# EAGLE design LaserScanner (EAGLE 9.1.3)
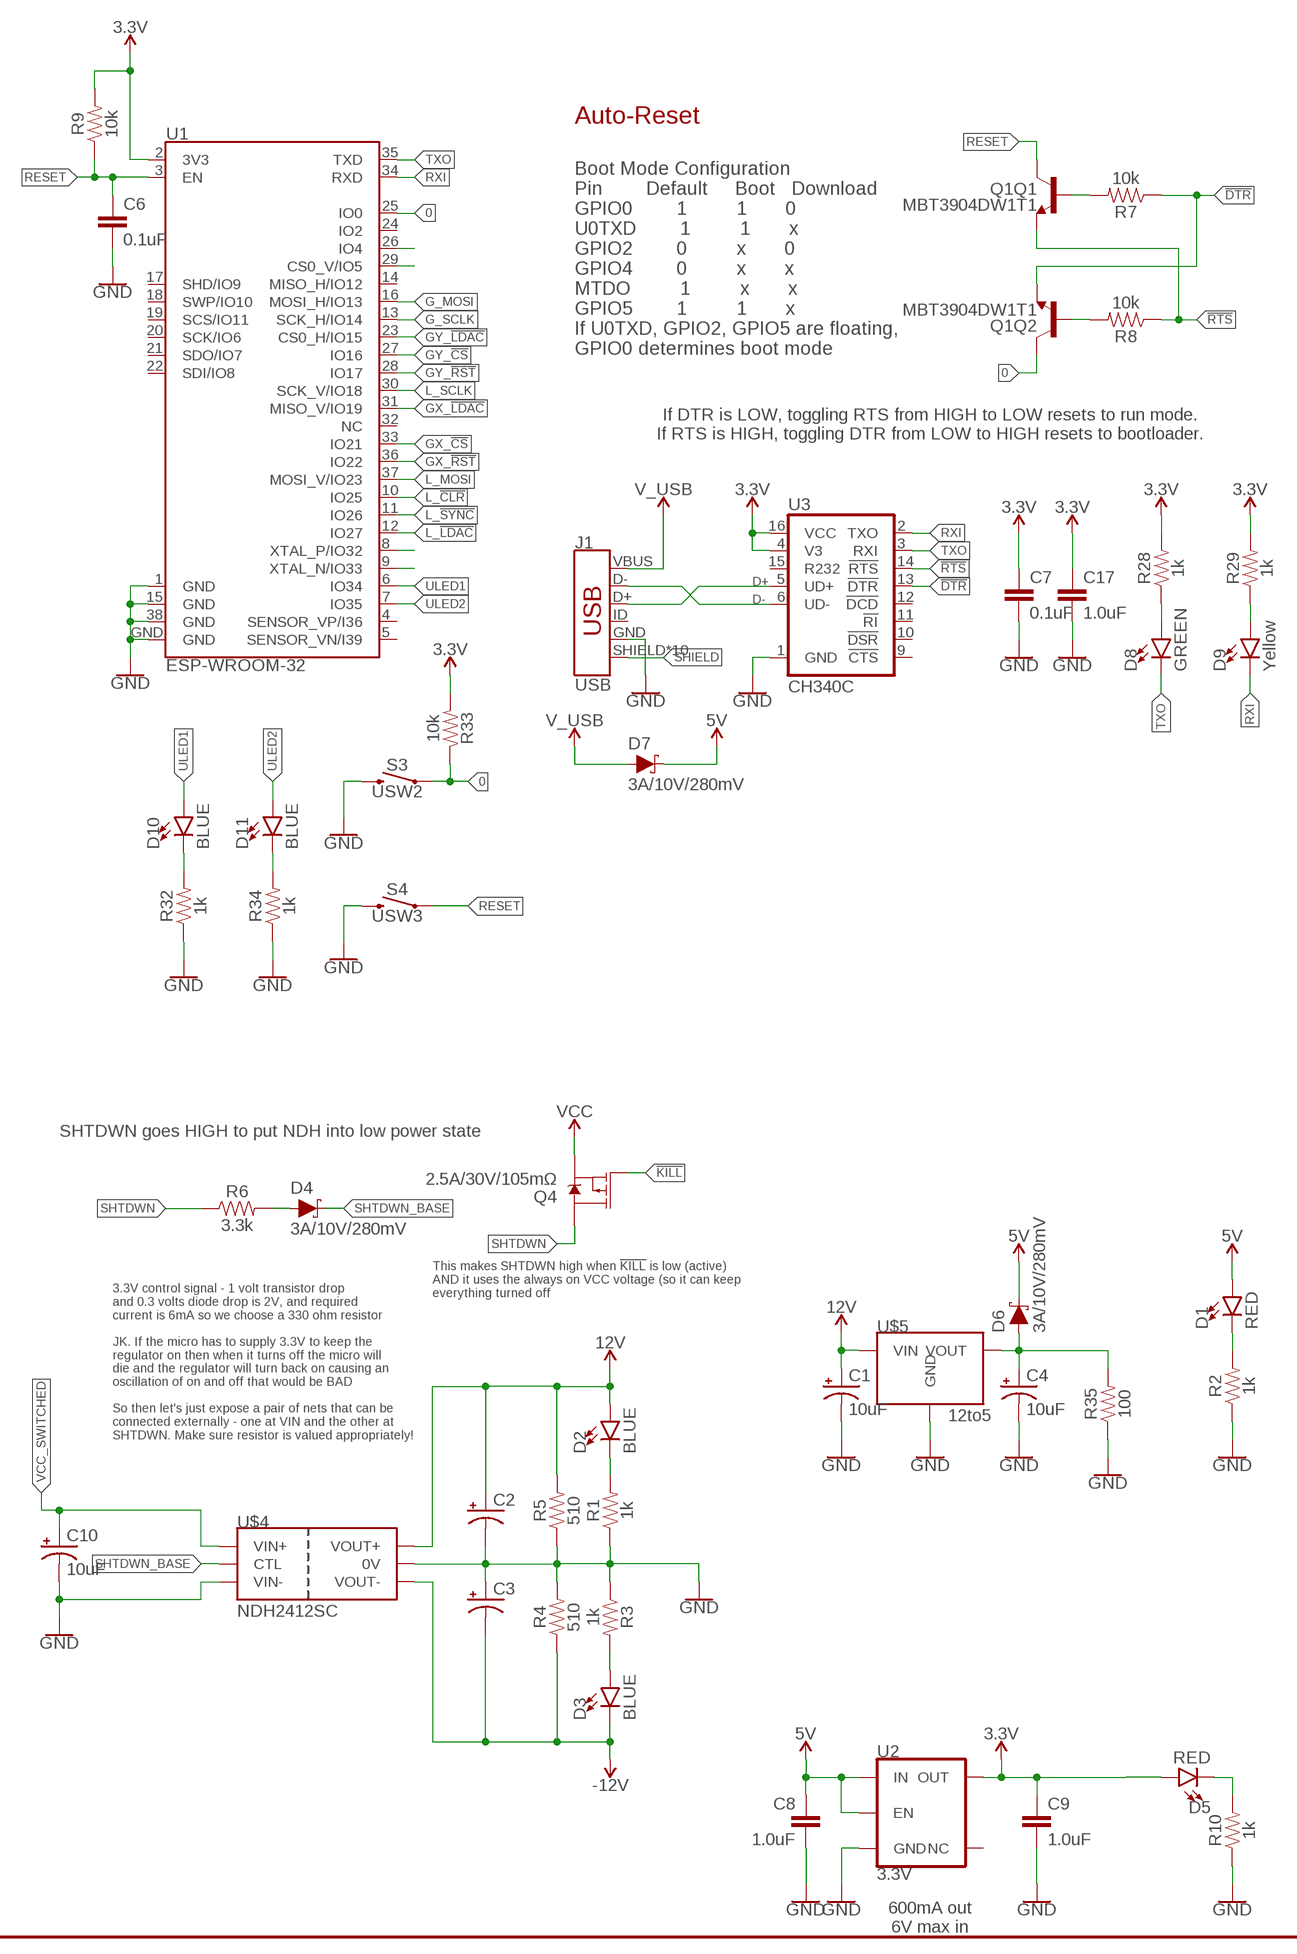
[diagram p0: schematic, sheet 1, part 1 of 2]
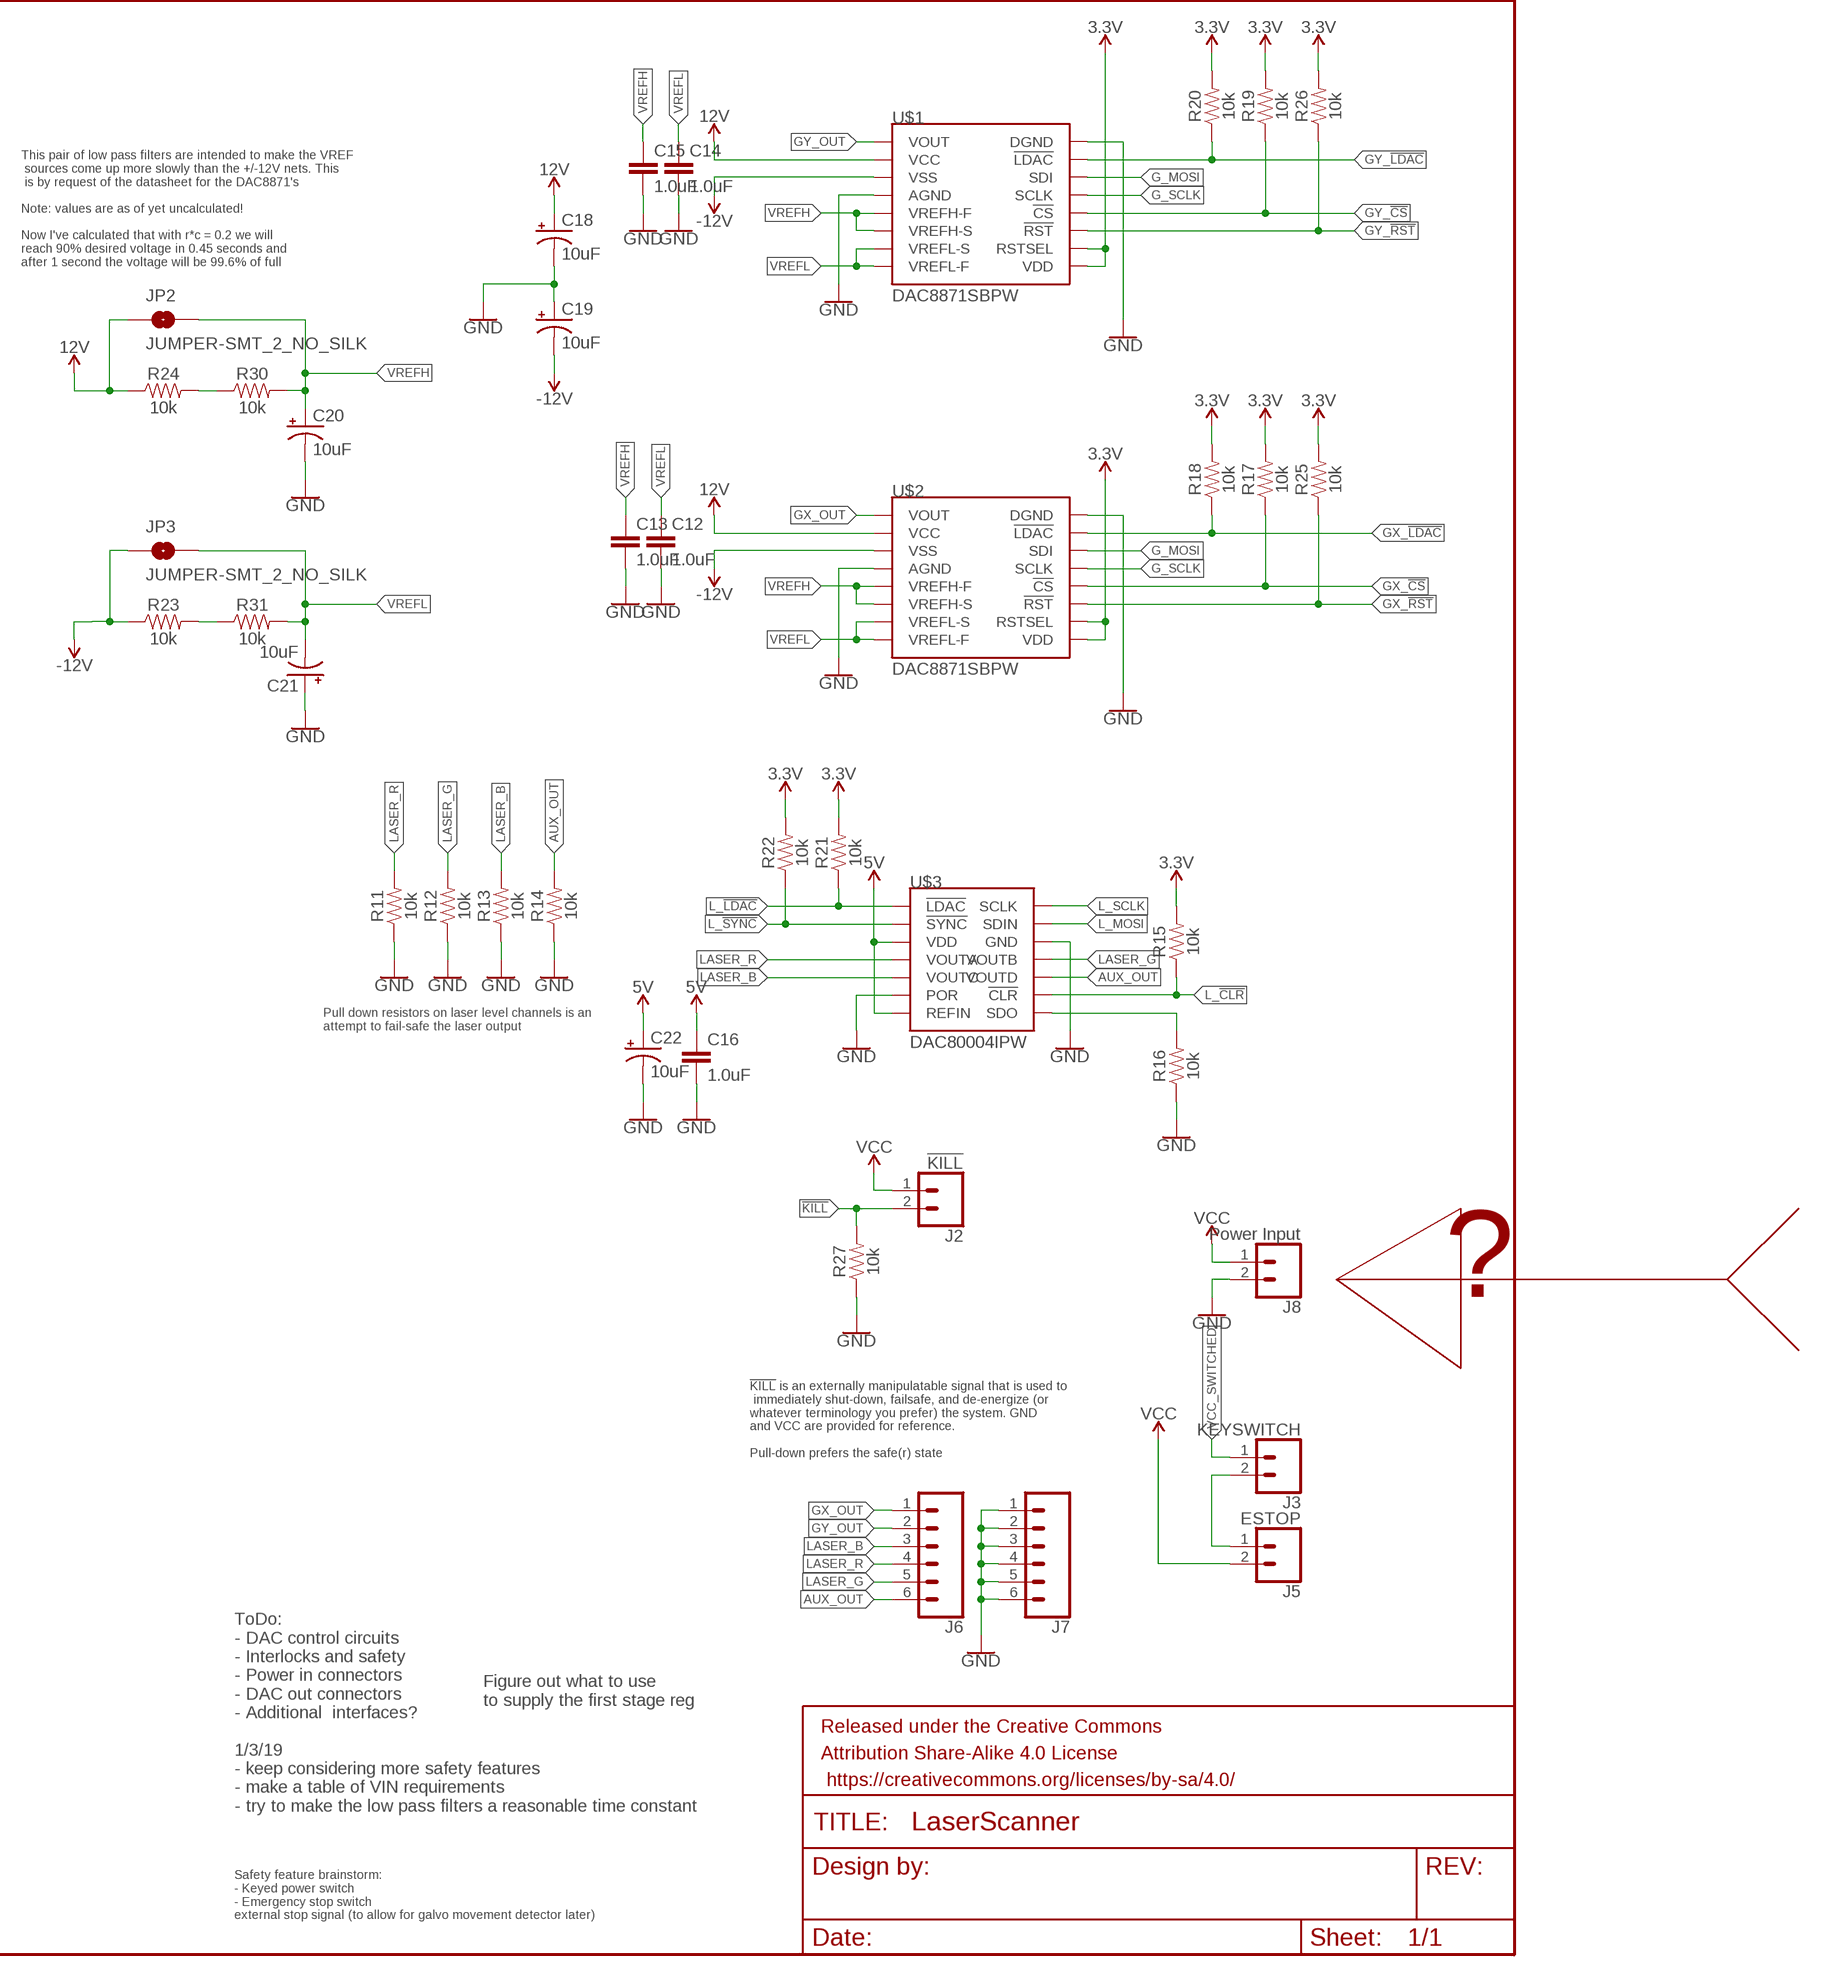
[diagram p1: schematic, sheet 1, part 2 of 2]

## Parts
C1  10uF  10UF-POLAR-EIA3216-16V-10%(TANT)  [EIA3216]
C2  47UF-POLAR-PANASONIC_D-50V-20%  [PANASONIC_D]
C3  47UF-POLAR-PANASONIC_D-50V-20%  [PANASONIC_D]
C4  10uF  10UF-POLAR-EIA3216-16V-10%(TANT)  [EIA3216]
C6  0.1uF  0.1UF-0603-25V-(+80/-20%)  [0603]
C7  0.1uF  0.1UF-0603-25V-5%  [0603]
C8  1.0uF  1.0UF-0603-16V-10%  [0603]
C9  1.0uF  1.0UF-0603-16V-10%  [0603]
C10  10uF  10UF-POLAR-EIA3216-16V-10%(TANT)  [EIA3216]
C12  1.0uF  1.0UF-0603-16V-10%-X7R  [0603]
C13  1.0uF  1.0UF-0603-16V-10%-X7R  [0603]
C14  1.0uF  1.0UF-0603-16V-10%-X7R  [0603]
C15  1.0uF  1.0UF-0603-16V-10%-X7R  [0603]
C16  1.0uF  1.0UF-0603-16V-10%-X7R  [0603]
C17  1.0uF  1.0UF-0603-16V-10%-X7R  [0603]
C18  10uF  10UF-POLAR-EIA3216-16V-10%(TANT)  [EIA3216]
C19  10uF  10UF-POLAR-EIA3216-16V-10%(TANT)  [EIA3216]
C20  10uF  10UF-POLAR-EIA3216-16V-10%(TANT)  [EIA3216]
C21  10uF  10UF-POLAR-EIA3216-16V-10%(TANT)  [EIA3216]
C22  10uF  10UF-POLAR-EIA3216-16V-10%(TANT)  [EIA3216]
D1  RED  LED-RED0603  [LED-0603]
D2  BLUE  LED-BLUE0603  [LED-0603]
D3  BLUE  LED-BLUE0603  [LED-0603]
D4  3A/10V/280mV  DIODE-SCHOTTKY-BAT60A  [SOD-323]
D5  RED  LED-RED0603  [LED-0603]
D6  3A/10V/280mV  DIODE-SCHOTTKY-BAT60A  [SOD-323]
D7  3A/10V/280mV  DIODE-SCHOTTKY-BAT60A  [SOD-323]
D8  GREEN  LED-GREEN0603  [LED-0603]
D9  Yellow  LED-YELLOW0603  [LED-0603]
D10  BLUE  LED-BLUE0603  [LED-0603]
D11  BLUE  LED-BLUE0603  [LED-0603]
FRAME1  FRAME-LEDGER  [CREATIVE_COMMONS]
J1  USB  USB_MICRO-B_HALF_PTH_MILL  [USB-MICROB-PTH-MILL]
J2  !KILL!  CONN_021X02_NO_SILK  [1X02_NO_SILK]
J3  KEYSWITCH  CONN_021X02_NO_SILK  [1X02_NO_SILK]
J5  ESTOP  CONN_021X02_NO_SILK  [1X02_NO_SILK]
J6  CONN_06NO_SILK_FEMALE_PTH  [1X06_NO_SILK]
J7  CONN_06NO_SILK_FEMALE_PTH  [1X06_NO_SILK]
J8  Power Input  CONN_021X02_NO_SILK  [1X02_NO_SILK]
JP2  JUMPER-SMT_2_NO_SILK  [SMT-JUMPER_2_NO_SILK]
JP3  JUMPER-SMT_2_NO_SILK  [SMT-JUMPER_2_NO_SILK]
Q1  MBT3904DW1T1  TRANS_NPN_DUAL-MBT3904DW1T1  [SC70-6]
Q4  2.5A/30V/105mΩ  MOSFET_PCH-DMG2307L  [SOT23-3]
R1  1k  1KOHM-0603-1/10W-1%  [0603]
R2  1k  1KOHM-0603-1/10W-1%  [0603]
R3  1k  1KOHM-0603-1/10W-1%  [0603]
R4  510  510OHM-2010-1/2W-5%  [2010]
R5  510  510OHM-2010-1/2W-5%  [2010]
R6  3.3k  3.3KOHM-0603-1/10W-1%  [0603]
R7  10k  10KOHM-0603-1/10W-1%  [0603]
R8  10k  10KOHM-0603-1/10W-1%  [0603]
R9  10k  10KOHM-0603-1/10W-1%  [0603]
R10  1k  1KOHM-0603-1/10W-1%  [0603]
R11  10k  10KOHM-0603-1/10W-1%  [0603]
R12  10k  10KOHM-0603-1/10W-1%  [0603]
R13  10k  10KOHM-0603-1/10W-1%  [0603]
R14  10k  10KOHM-0603-1/10W-1%  [0603]
R15  10k  10KOHM-0603-1/10W-1%  [0603]
R16  10k  10KOHM-0603-1/10W-1%  [0603]
R17  10k  10KOHM-0603-1/10W-1%  [0603]
R18  10k  10KOHM-0603-1/10W-1%  [0603]
R19  10k  10KOHM-0603-1/10W-1%  [0603]
R20  10k  10KOHM-0603-1/10W-1%  [0603]
R21  10k  10KOHM-0603-1/10W-1%  [0603]
R22  10k  10KOHM-0603-1/10W-1%  [0603]
R23  10k  10KOHM-0603-1/10W-1%  [0603]
R24  10k  10KOHM-0603-1/10W-1%  [0603]
R25  10k  10KOHM-0603-1/10W-1%  [0603]
R26  10k  10KOHM-0603-1/10W-1%  [0603]
R27  10k  10KOHM-0603-1/10W-1%  [0603]
R28  1k  1KOHM-0603-1/10W-1%  [0603]
R29  1k  1KOHM-0603-1/10W-1%  [0603]
R30  10k  10KOHM-0603-1/10W-1%  [0603]
R31  10k  10KOHM-0603-1/10W-1%  [0603]
R32  1k  1KOHM-0603-1/10W-1%  [0603]
R33  10k  10KOHM-0603-1/10W-1%  [0603]
R34  1k  1KOHM-0603-1/10W-1%  [0603]
R35  100  100OHM-0603-1/4W-5%  [0603]
S3  USW2  MOMENTARY-SWITCH-SPST-SMD-5.2-REDUNDANT  [TACTILE_SWITCH_SMD_5.2MM]
S4  USW3  MOMENTARY-SWITCH-SPST-SMD-5.2-REDUNDANT  [TACTILE_SWITCH_SMD_5.2MM]
U1  ESP-WROOM-32  [ESP-WROOM-32]
U2  3.3V  V_REG_AP2112K-3.3V  [SOT23-5]
U3  CH340C  [SO016]
U$1  DAC8871SBPW  [TSSOP16]
U$2  DAC8871SBPW  [TSSOP16]
U$3  DAC80004IPW  [TSSOP14]
U$4  NDH2412SC  [NDH]
U$5  12to5  R-78E3.3-1.0  [RE-78E]

## Nets
0: Q1.6(Q2:C) R33.1 S3.1 S3.2 U1.25(IO0)
3.3V: C7.1 C9.1 C17.1 D5.A R9.2 R15.2 R17.2 R18.2 R19.2 R20.2 R21.2 R22.2 R25.2 R26.2 R28.2 R29.2 R33.2 U1.2(3V3) U2.5(OUT) U3.4(V3) U3.16(VCC) U$1.9(VDD) U$1.10(RSTSEL) U$2.9(VDD) U$2.10(RSTSEL)
5V: C8.1 C16.1 C22.+ D1.A D6.C D7.C U2.1(IN) U2.3(EN) U$3.3(VDD) U$3.7(REFIN)
12V: C1.+ C2.+ C18.+ D2.A JP2.1 R5.2 R24.1 U$1.2(VCC) U$2.2(VCC) U$4.6(VOUT+) U$5.1(VIN)
!DTR: Q1.1(Q2:E) R7.1 U3.13(!DTR)
!KILL: J2.2 Q4.1(G) R27.2
!RTS: Q1.4(Q1:E) R8.1 U3.14(!RTS)
-12V: C3.- C19.- D3.C JP3.1 R4.1 R23.1 U$1.3(VSS) U$2.3(VSS) U$4.9(VOUT-)
AUX_OUT: J6.6 R14.2 U$3.10(VOUTD)
D+: J1.D+ U3.5(UD+)
D-: J1.D- U3.6(UD-)
G_MOSI: U1.16(MOSI_H/IO13) U$1.14(SDI) U$2.14(SDI)
G_SCLK: U1.13(SCK_H/IO14) U$1.13(SCLK) U$2.13(SCLK)
GND: C1.- C2.- C3.+ C4.- C6.2 C7.2 C8.2 C9.2 C10.- C12.2 C13.2 C14.2 C15.2 C16.2 C17.2 C18.- C19.+ C20.- C21.+ C22.- J1.GND J7.1 J7.2 J7.3 J7.4 J7.5 J7.6 J8.2 R1.1 R2.1 R3.1 R4.2 R5.1 R10.1 R11.1 R12.1 R13.1 R14.1 R16.1 R27.1 R32.1 R34.1 R35.1 S3.3 S3.4 S4.3 S4.4 U1.1(GND) U1.15(GND) U1.38(GND) U1.GND U2.2(GND) U3.1(GND) U$1.4(AGND) U$1.16(DGND) U$2.4(AGND) U$2.16(DGND) U$3.6(POR) U$3.12(GND) U$4.1(VIN-) U$4.7(0V) U$5.2(GND)
GX_!CS: R17.1 U1.33(IO21) U$2.12(!CS)
GX_!LDAC: R18.1 U1.31(MISO_V/IO19) U$2.15(!LDAC)
GX_!RST: R25.1 U1.36(IO22) U$2.11(!RST)
GX_OUT: J6.1 U$2.1(VOUT)
GY_!CS: R19.1 U1.27(IO16) U$1.12(!CS)
GY_!LDAC: R20.1 U1.23(CS0_H/IO15) U$1.15(!LDAC)
GY_!RST: R26.1 U1.28(IO17) U$1.11(!RST)
GY_OUT: J6.2 U$1.1(VOUT)
L_!CLR: R15.1 U1.10(IO25) U$3.9(!CLR)
L_!LDAC: R21.1 U1.12(IO27) U$3.1(!LDAC)
L_!SYNC: R22.1 U1.11(IO26) U$3.2(!SYNC)
L_MOSI: U1.37(MOSI_V/IO23) U$3.13(SDIN)
L_SCLK: U1.30(SCK_V/IO18) U$3.14(SCLK)
LASER_B: J6.3 R13.2 U$3.5(VOUTC)
LASER_G: J6.5 R12.2 U$3.11(VOUTB)
LASER_R: J6.4 R11.2 U$3.4(VOUTA)
N$1: D1.C R2.2
N$2: R16.2 U$3.8(SDO)
N$3: D2.C R1.2
N$4: D4.A R6.2
N$5: D3.A R3.2
N$6: D5.C R10.2
N$7: C4.+ D6.A R35.2 U$5.3(VOUT)
N$8: U1.26(IO4)
N$9: J3.2 J5.1
N$10: Q1.5(Q1:B) R7.2
N$11: U1.29(CS0_V/IO5)
N$12: Q1.2(Q2:B) R8.2
N$13: D8.A R28.1
N$14: D9.A R29.1
N$15: R24.2 R30.1
N$16: R23.2 R31.1
N$17: D10.C R32.2
N$18: D11.C R34.2
N$22: U1.8(XTAL_P/IO32)
N$23: U1.9(XTAL_N/IO33)
RESET: C6.1 Q1.3(Q1:C) R9.1 S4.1 S4.2 U1.3(EN)
RXI: D9.C U1.34(RXD) U3.2(TXO)
SHIELD: J1.SHIELD J1.SHIELD2(SHIELD) J1.SHIELD3(SHIELD) J1.SHIELD4(SHIELD) J1.SHIELD5(SHIELD) J1.SHIELD6(SHIELD) J1.SHIELD7(SHIELD) J1.SHIELD8(SHIELD) J1.SHIELD9(SHIELD) J1.SHIELD10(SHIELD)
SHTDWN: Q4.3(D) R6.1
SHTDWN_BASE: D4.C U$4.3(CTL)
TXO: D8.C U1.35(TXD) U3.3(RXI)
ULED1: D10.A U1.6(IO34)
ULED2: D11.A U1.7(IO35)
V_USB: D7.A J1.VBUS
VCC: J2.1 J5.2 J8.1 Q4.2(S)
VCC_SWITCHED: C10.+ J3.1 U$4.2(VIN+)
VREFH: C13.1 C15.1 C20.+ JP2.2 R30.2 U$1.5(VREFH-F) U$1.6(VREFH-S) U$2.5(VREFH-F) U$2.6(VREFH-S)
VREFL: C12.1 C14.1 C21.- JP3.2 R31.2 U$1.7(VREFL-S) U$1.8(VREFL-F) U$2.7(VREFL-S) U$2.8(VREFL-F)
Unconnected: J1.ID U1.4(SENSOR_VP/I36) U1.5(SENSOR_VN/I39) U1.14(MISO_H/IO12) U1.17(SHD/IO9) U1.18(SWP/IO10) U1.19(SCS/IO11) U1.20(SCK/IO6) U1.21(SDO/IO7) U1.22(SDI/IO8) U1.24(IO2) U1.32(NC) U2.4(NC) U3.9(!CTS) U3.10(!DSR) U3.11(!RI) U3.12(!DCD) U3.15(R232)

## Notes on the sheet
- Auto-Reset
- This pair of low pass filters are intended to make the VREF
   sources come up more slowly than the +/-12V nets. This
   is by request of the datasheet for the DAC8871's
  
  Note: values are as of yet uncalculated!
  
  Now I've calculated that with r*c = 0.2 we will 
  reach 90% desired voltage in 0.45 seconds and 
  after 1 second the voltage will be 99.6% of full
- Boot Mode Configuration
  Pin        Default     Boot   Download
  GPIO0        1         1       0
  U0TXD        1         1       x
  GPIO2        0         x       0
  GPIO4        0         x       x
  MTDO         1         x       x
  GPIO5        1         1       x
  If U0TXD, GPIO2, GPIO5 are floating, 
  GPIO0 determines boot mode
- If DTR is LOW, toggling RTS from HIGH to LOW resets to run mode.
  If RTS is HIGH, toggling DTR from LOW to HIGH resets to bootloader.
- Pull down resistors on laser level channels is an 
  attempt to fail-safe the laser output
- SHTDWN goes HIGH to put NDH into low power state
- ?
- This makes SHTDWN high when !KILL! is low (active)
  AND it uses the always on VCC voltage (so it can keep 
  everything turned off
- 3.3V control signal - 1 volt transistor drop 
  and 0.3 volts diode drop is 2V, and required 
  current is 6mA so we choose a 330 ohm resistor
  
  JK. If the micro has to supply 3.3V to keep the 
  regulator on then when it turns off the micro will 
  die and the regulator will turn back on causing an 
  oscillation of on and off that would be BAD
  
  So then let's just expose a pair of nets that can be 
  connected externally - one at VIN and the other at 
  SHTDWN. Make sure resistor is valued appropriately!
- !KILL! is an externally manipulatable signal that is used to
   immediately shut-down, failsafe, and de-energize (or 
  whatever terminology you prefer) the system. GND 
  and VCC are provided for reference.
  
  Pull-down prefers the safe(r) state
- Figure out what to use
  to supply the first stage reg
- ToDo: 
  - DAC control circuits
  - Interlocks and safety
  - Power in connectors
  - DAC out connectors
  - Additional  interfaces?
  
  1/3/19
  - keep considering more safety features
  - make a table of VIN requirements
  - try to make the low pass filters a reasonable time constant
- 600mA out
  6V max in
- Safety feature brainstorm:
  - Keyed power switch
  - Emergency stop switch
  external stop signal (to allow for galvo movement detector later)

## Library data of the parts
C1 C4 C10 C18-C22 = SparkFun-Capacitors:10UF-POLAR: 10.0µF polarized capacitors A capacitor is a passive two-terminal electrical component used to store electrical energy temporarily in an electric field.; PROD_ID: CAP-00811
C2 C3 = SparkFun-Capacitors:47UF-POLAR: 47µF polarized capacitors A capacitor is a passive two-terminal electrical component used to store electrical energy temporarily in an electric field.
C6 = SparkFun-Capacitors:0.1UF: 0.1µF ceramic capacitors A capacitor is a passive two-terminal electrical component used to store electrical energy temporarily in an electric field.; PROD_ID: CAP-00810
C7 = SparkFun-Capacitors:0.1UF: 0.1µF ceramic capacitors A capacitor is a passive two-terminal electrical component used to store electrical energy temporarily in an electric field.; PROD_ID: CAP-08604
C8 C9 = SparkFun-Capacitors:1.0UF: 1µF ceramic capacitors A capacitor is a passive two-terminal electrical component used to store electrical energy temporarily in an electric field.; PROD_ID: CAP-00868
C12-C17 = SparkFun-Capacitors:1.0UF: 1µF ceramic capacitors A capacitor is a passive two-terminal electrical component used to store electrical energy temporarily in an electric field.; PROD_ID: CAP-13930
D1 D5 = SparkFun-LED:LED-RED: Red SMD LED Used in manufacturing of most products at SparkFun Packages: 0603 - SMD 0603 package [Product Link] <http://docs.avagotech.com/docs/AV02-0551EN> 0603 SMART - SMD 0603 SMART package ( more efficient and expensive)[Product Link] <http://www.osram-os.com/Graphics/XPic2/00077099_0.pdf> 1206 - SMD1206 package [Product Link] <https://www.sparkfun.com/datasheets/DevTools/LilyPad/Q150OVS4.pdff> SparkFun Products: Pro Mini 328 -5V <https://www.sparkfun.com/products/821> RedBoard <https://www.sparkfun.com/products/12757> IOIO-OTG <https://www.sparkfun.com/products/13613>; PROD_ID: DIO-00819
D2 D3 D10 D11 = SparkFun-LED:LED-BLUE: Blue SMD LED Used in manufacturing of various products at SparkFun Packages: 0603 - SMD 0603 package [Product Link] <http://www.digikey.com/product-detail/en/SMLE12BC7TT86/511-1589-2-ND/1641808> 1206 - SMD1206 package [Product Link] <http://www.digikey.com/product-detail/en/lite-on-inc/LTST-C150TBKT/160-1643-1-ND/573584> SparkFun Products: ESP8266 Thing-Dev Board <https://www.sparkfun.com/products/13711> RedBoard <https://www.sparkfun.com/products/12757>; PROD_ID: DIO-08575
D4 D6 D7 = SparkFun-DiscreteSemi:DIODE-SCHOTTKY: Schottky diode A Schottky diode is a semiconductor diode which has a low forward voltage drop and a very fast switching action.; PROD_ID: DIO-14072
D8 = SparkFun-LED:LED-GREEN: Green SMD LED Used in manufacturing of various products at SparkFun Packages: 0603 - SMD 0603 package [Product Link] <http://www.futureelectronics.com/en/technologies/semiconductors/optoelectronics/leds/Pages/9894312-LTST-C190GKT.aspx?CrossPart=HSMG-C190&IM=0> LilyPad 1206 - SMD1206 LilyPad package [Product Link] <http://www.futureelectronics.com/en/Technologies/Product.aspx?ProductID=IN150NGHARVATEKCORPORATION2049943&IM=0> 1206 - SMD1206 package [Product Link] <http://www.futureelectronics.com/en/technologies/semiconductors/optoelectronics/leds/Pages/8315665-LTST-C150KGKT.aspx?IM=0> 1206 Bottom Mount -SMD 1206 Bottom Mount [Product Link] <http://www.digikey.com/product-detail/en/lite-on-inc/LTST-C230KGKT/160-1456-1-ND/386854> SparkFun Products: Pro Mini 328 -5V <https://www.sparkfun.com/products/821> RedBoard <https://www.sparkfun.com/products/12757> MP3 Trigger <https://www.sparkfun.com/products/13720> Makey Makey <https://www.sparkfun.com/products/11076>; PROD_ID: DIO-00821
D9 = SparkFun-LED:LED-YELLOW: Yellow SMD LED Used in manufacturing several products at SparkFun. Packages: 0603 - SMD 0603 package[Product Link] <http://www.kingbrightusa.com/product.asp?catalog_name=LED&product_id=APT1608SYCK> 0603 -SMART - SMART SMD 0603 package (more efficient/more expensive) [Product Link] <http://www.osram-os.com/osram_os/en/products/product-catalog/led-light-emitting-diodes/smartled-0603/ly-l29k/index.jsp> LilyPad - SMD1206 package[Product Datasheet] <https://www.sparkfun.com/datasheets/DevTools/LilyPad/Q150YUS4.pdf> SparkFun Products: Blynk Board <https://www.sparkfun.com/products/13794> IOIO-OTG <https://www.sparkfun.com/products/13613> XBee Explorer Serial <https://www.sparkfun.com/products/13225>; PROD_ID: DIO-09003
FRAME1 = SparkFun-Aesthetics:FRAME-LEDGER: Schematic Frame - Ledger Standard 11x14 US Ledger frame
J1 = SparkFun-Connectors:USB_MICRO-B: USB Type Micro-B Connector Male/female and PTH/SMT variants SparkFun Products: SparkFun microB USB Breakout <https://www.sparkfun.com/products/12035> SparkFun USB microB Plug Breakout <https://www.sparkfun.com/products/10031> SparkFun ESP8266 Thing <https://www.sparkfun.com/products/13231>; PROD_ID: CONN-13711
J2 J3 J5 J8 = SparkFun-Connectors:CONN_02: Multi connection point. Often used as Generic Header-pin footprint for 0.1 inch spaced/style header connections On any of the 0.1 inch spaced packages, you can populate with these: Break Away Headers - Straight <https://www.sparkfun.com/products/116> (PRT-00116) Break Away Male Headers - Right Angle <https://www.sparkfun.com/products/553> (PRT-00553) Female Headers <https://www.sparkfun.com/products/115> (PRT-00115) Break Away Headers - Machine Pin <https://www.sparkfun.com/products/117> (PRT-00117) Break Away Female Headers - Swiss Machine Pin <https://www.sparkfun.com/products/743> (PRT-00743) For SCREWTERMINALS and SPRING TERMINALS visit here: Screw Terimnals on SparkFun.com <https://www.sparkfun.com/search/results?term=Screw+Terminals> (5mm/3.5mm/2.54mm spacing) This device is also useful as a general connection point to wire up your design to another part of your project. Our various solder wires solder well into these plated through hole pads. Hook-Up Wire - Assortment (Stranded, 22 AWG) <https://www.sparkfun.com/products/11375> (PRT-11375) Hook-Up Wire - Assortment (Solid Core, 22 AWG) <https://www.sparkfun.com/products/11367> (PRT-11367) View the entire wire category on our website here <https://www.sparkfun.com/categories/141> Special notes: Molex polarized connector foot print use with: PRT-08233 with associated crimp pins and housings. 2.54_SCREWTERM for use with PRT-10571. 3.5mm Screw Terminal footprints for PRT-08084 5mm Screw Terminal footprints for use with PRT-08432
J6 J7 = SparkFun-Connectors:CONN_06: Multi connection point. Often used as Generic Header-pin footprint for 0.1 inch spaced/style header connections On any of the 0.1 inch spaced packages, you can populate with these: Break Away Headers - Straight <https://www.sparkfun.com/products/116> (PRT-00116) Break Away Male Headers - Right Angle <https://www.sparkfun.com/products/553> (PRT-00553) Female Headers <https://www.sparkfun.com/products/115> (PRT-00115) Break Away Headers - Machine Pin <https://www.sparkfun.com/products/117> (PRT-00117) Break Away Female Headers - Swiss Machine Pin <https://www.sparkfun.com/products/743> (PRT-00743) Arduino Stackable Header - 6 Pin <https://www.sparkfun.com/products/9280> (PRT-09280) For SCREWTERMINALS and SPRING TERMINALS visit here: Screw Terimnals on SparkFun.com <https://www.sparkfun.com/search/results?term=Screw+Terminals> (5mm/3.5mm/2.54mm spacing) This device is also useful as a general connection point to wire up your design to another part of your project. Our various solder wires solder well into these plated through hole pads. Hook-Up Wire - Assortment (Stranded, 22 AWG) <https://www.sparkfun.com/products/11375> (PRT-11375) Hook-Up Wire - Assortment (Solid Core, 22 AWG) <https://www.sparkfun.com/products/11367> (PRT-11367) View the entire wire category on our website here <https://www.sparkfun.com/categories/141>; PROD_ID: CONN-08437
JP2 JP3 = SparkFun-Jumpers:JUMPER-SMT_2_NO: Normally open jumper This jumper has two pads in close proximity to each other. Apply solder to close the connection. Round pads are easier to solder for beginners, but are a lot larger. SparkFun Product that uses the round pads: SparkFun EL Sequencer <https://www.sparkfun.com/products/12781>
Q1 = SparkFun-DiscreteSemi:TRANS_NPN_DUAL: Dual NPN Transistors in Single Package The MBT3904W1 puts two general purpose 3904 NPN transistors in a single package. Datasheet <http://www.onsemi.com/pub_link/Collateral/MBT3904DW1T1-D.PDF> SparkFun Products: SparkFun ESP32 Thing <https://www.sparkfun.com/products/13907>; PROD_ID: TRANS-13337
Q4 = SparkFun-DiscreteSemi:MOSFET_PCH: P-channel MOSFETs Voltage controlled devices that allow control of high current outputs. SparkFun Products: SparkFun ESP32 Thing <https://www.sparkfun.com/products/13907> SparkFun ESP8266 Thing <https://www.sparkfun.com/products/13231>; PROD_ID: TRANS-11308
R1-R3 R10 R28 R29 R32 R34 = SparkFun-Resistors:1KOHM: 1kΩ resistor A resistor is a passive two-terminal electrical component that implements electrical resistance as a circuit element. Resistors act to reduce current flow, and, at the same time, act to lower voltage levels within circuits. - Wikipedia; PROD_ID: RES-07856
R4 R5 = SparkFun-Resistors:510OHM: 510Ω resistor A resistor is a passive two-terminal electrical component that implements electrical resistance as a circuit element. Resistors act to reduce current flow, and, at the same time, act to lower voltage levels within circuits. - Wikipedia; PROD_ID: RES-08717
R6 = SparkFun-Resistors:3.3KOHM: 3.3kΩ resistor A resistor is a passive two-terminal electrical component that implements electrical resistance as a circuit element. Resistors act to reduce current flow, and, at the same time, act to lower voltage levels within circuits. - Wikipedia; PROD_ID: RES-07851
R7-R9 R11-R27 R30 R31 R33 = SparkFun-Resistors:10KOHM: 10kΩ resistor A resistor is a passive two-terminal electrical component that implements electrical resistance as a circuit element. Resistors act to reduce current flow, and, at the same time, act to lower voltage levels within circuits. - Wikipedia; PROD_ID: RES-00824
R35 = SparkFun-Resistors:100OHM: 100Ω resistor A resistor is a passive two-terminal electrical component that implements electrical resistance as a circuit element. Resistors act to reduce current flow, and, at the same time, act to lower voltage levels within circuits. - Wikipedia; PROD_ID: RES-12438
S3 S4 = SparkFun-Switches:MOMENTARY-SWITCH-SPST: Momentary Switch (Pushbutton) - SPST Normally-open (NO) SPST momentary switches (buttons, pushbuttons). Variants PTH-12MM - 12mm square, through-hole Momentary Pushbutton Switch - 12mm Square <https://www.sparkfun.com/products/9190> (COM-09190) PTH-6.0MM, PTH-6.0MM-KIT - 6.0mm square, through-hole Mini Pushbutton Switch <https://www.sparkfun.com/products/97> (COM-00097) KIT package intended for soldering kit's - only one side of pads' copper is exposed. PTH-RIGHT-ANGLE-KIT - Right-angle, through-hole Right Angle Tactile Button <https://www.sparkfun.com/products/10791> - Used on SparkFun BigTime Watch Kit <https://www.sparkfun.com/products/11734> SMD-12MM - 12mm square, surface-mount Tactile Button - SMD (12mm) <https://www.sparkfun.com/products/12993> (COM-12993) Used on SparkFun PicoBoard <https://www.sparkfun.com/products/11888> SMD-4.5MM - 4.5mm Square Trackball Switch Used on SparkFun Blackberry Trackballer Breakout <https://www.sparkfun.com/products/13169> SMD-4.6MMX2.8MM - 4.60mm x 2.80mm, surface mount Used on SparkFun SAMD21 Mini Breakout <https://www.sparkfun.com/products/13664> SMD-5.2MM, SMD-5.2-REDUNDANT - 5.2mm square, surface-mount Mini Pushbutton Switch - SMD <https://www.sparkfun.com/products/8720> (COM-08720) Used on Arduino Pro Mini <https://www.sparkfun.com/products/11114> REDUNDANT package connects both switch circuits together SMD-6.0X3.5MM - 6.0 x 3.5mm, surface mount Momentary Reset Switch SMD <https://www.sparkfun.com/products/8229> (COM-08229) SMD-6.2MM-TALL - 6.2mm square, surface mount Tactile Button - SMD (6mm) <https://www.sparkfun.com/products/12992> Used on SparkFun Digital Sandbox <https://www.sparkfun.com/products/12651> SMD-RIGHT-ANGLE - Right-angle, surface mount Used on SparkFun Block for Intel® Edison - Arduino <https://www.sparkfun.com/products/13036>; PROD_ID: SWCH-08247; SF_SKU: COM-08720
U1 = SparkFun-RF:ESP-WROOM-32; PROD_ID: IC-13849
U2 = SparkFun-IC-Power:V_REG_AP2112: AP2112 - 600mA CMOS LDO Regulator w/ Enable The AP2112 is CMOS process low dropout linear regulator with enable function, the regulator delivers a guaranteed 600mA (min.) continuous load current. Features Output Voltage Accuracy: ±1.5% Output Current: 600mA (Min.) Foldback Short Current Protection: 50mA Enable Function to Turn ON/OFF VOUT Low Dropout Voltage (3.3V): 250mV (Typ.) @IOUT=600mA Excellent Load Regulation: 0.2%/A (Typ.) Excellent Line Regulation: 0.02%/V (Typ.) Low Quiescent Current: 55μA (Typ.) Low Standby Current: 0.01μA (Typ.) Low Output Noise: 50μVRMS PSRR: 100Hz -65dB, 1kHz -65dB OTSD Protection Stable with 1.0μF Flexible Cap: Ceramic, Tantalum and Aluminum Electrolytic Operation Temperature Range: -40°C to 85°C ESD: MM 400V, HBM 4000V; PROD_ID: VREG-12457
U3 = SparkFun-IC-Comms:CH340C; PROD_ID: IC-14038
U$1 U$2 = laserscanner:DAC8871SBPW
U$3 = laserscanner:DAC80004IPW
U$4 = laserscanner:NDH2412SC
U$5 = laserscanner:R-78E3.3-1.0

## Board
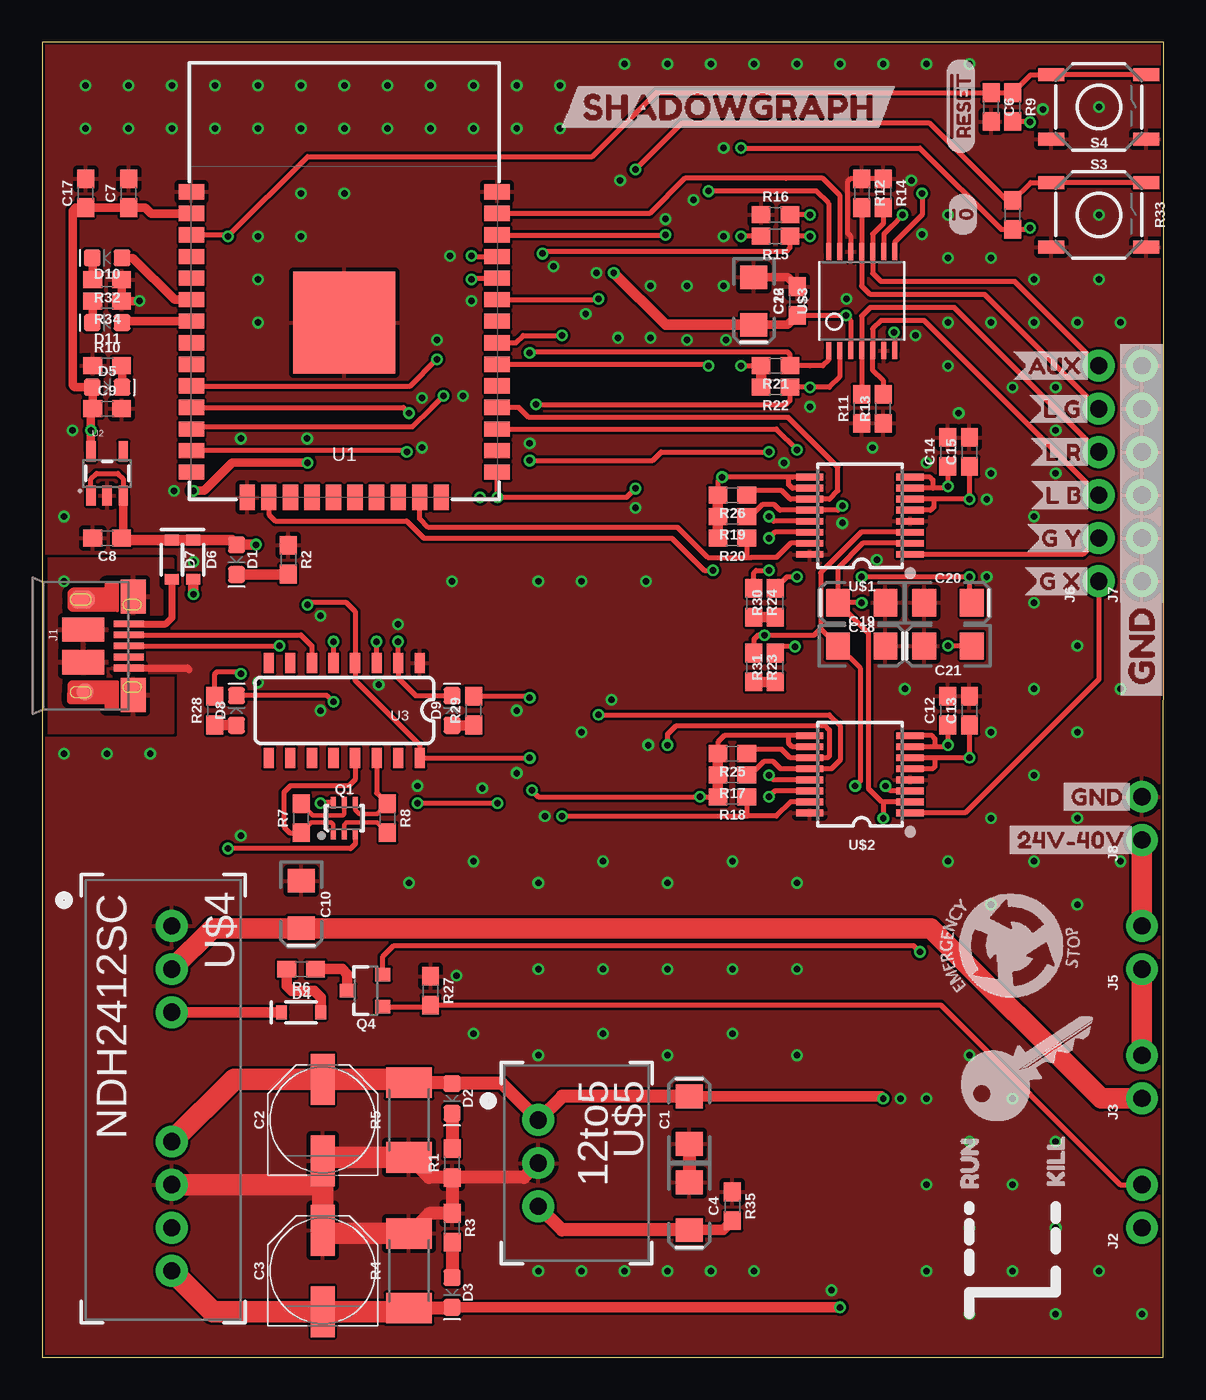
[diagram p2: board, top side]
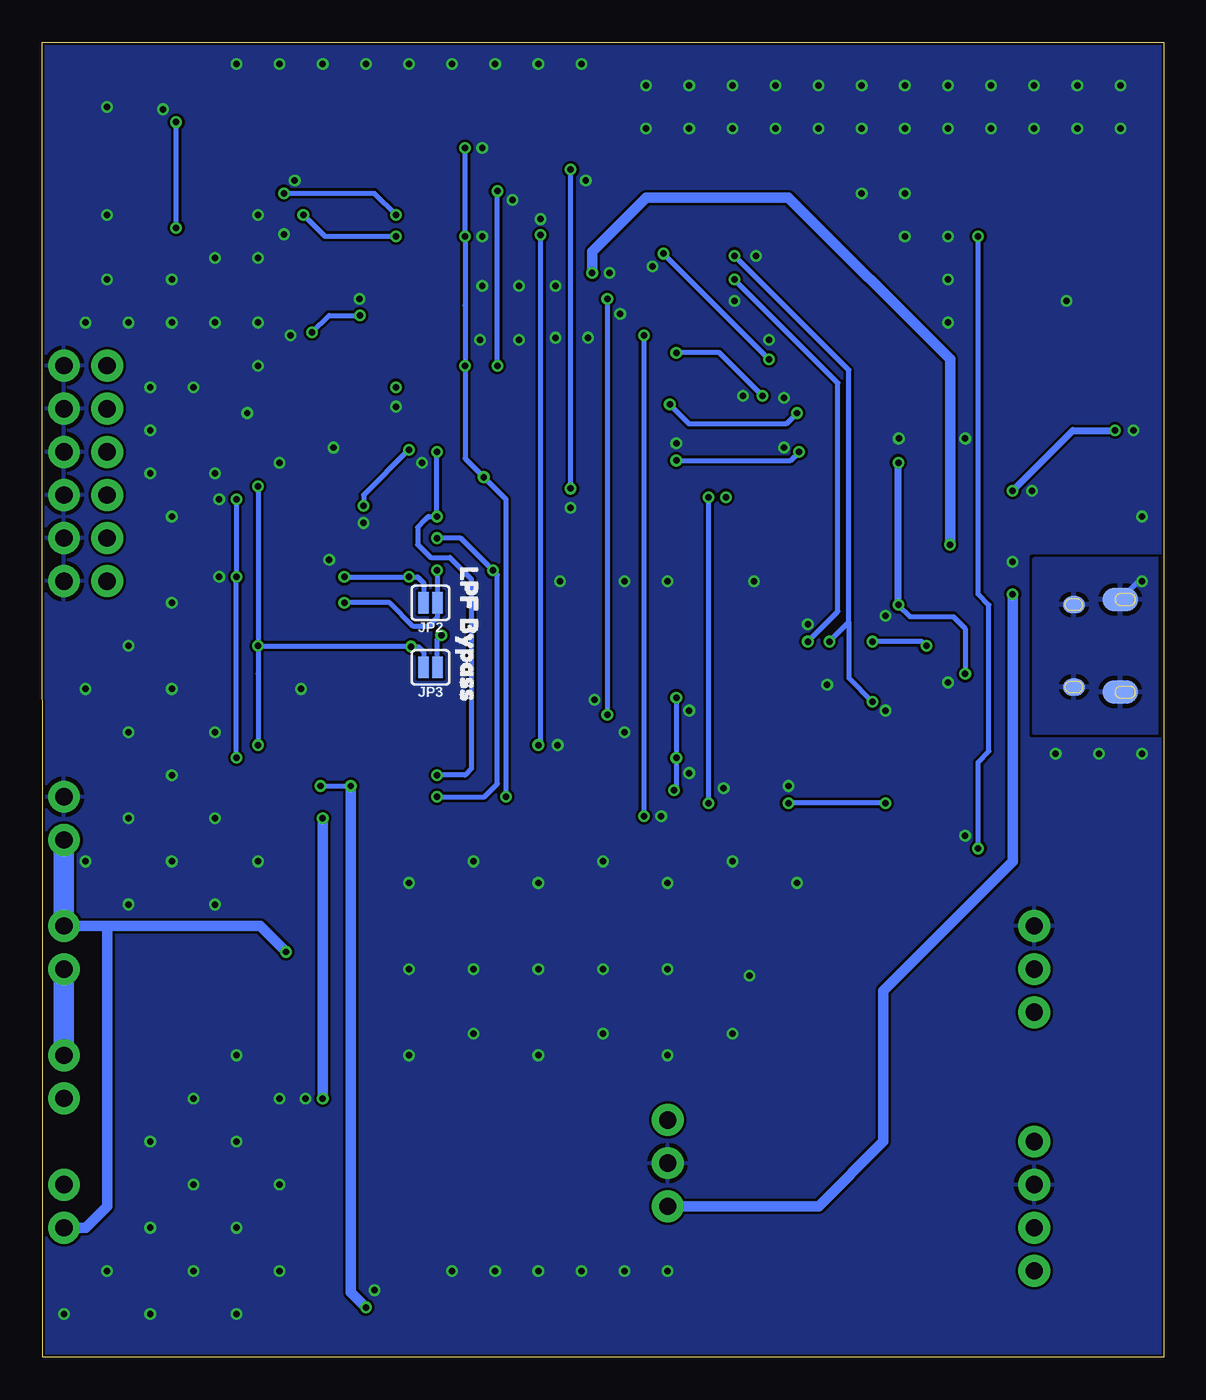
[diagram p3: board, bottom side, seen from below]

Size 66.04 x 77.47 mm. Coordinates in mm from the lower left corner, seen from the top.
Outline: 0,0 66.02,0 66.04,77.47 0,77.47 0,0
Copper layers (1*16): Top 0.035mm / dielectric 1.5mm / Bottom 0.035mm
Design rules "SparkFun-2-layer-PCBWay-LIMIT": minimum track width 6mil, minimum drill 0.3mm, track to track 6mil, track to pad 6mil, pad to pad 6mil, via to via 6mil, smd to smd 6mil, copper to edge 6mil, drill to drill 6mil, minimum pad ring 6mil, minimum via ring 6mil, stop-mask expansion 4mil, vias tented up to drill 25mil, thermal gap 10mil

### Footprints (pad centres in the part's own frame; a part is rotated, then mirrored left to right if it is on the bottom)
EIA3216 = smd 1.4 x 1.6: + 1.4,0; - -1.4,0
PANASONIC_D = smd 3 x 1.4: + 2.4,0; - -2.4,0
0603 = smd 1.1 x 1: 1 -0.85,0; 2 0.85,0
LED-0603 = smd 1 x 1: A -0.877,0; C 0.877,0
SOD-323 = smd 0.63 x 0.83: A 1.15,0; C -1.15,0
USB-MICROB-PTH-MILL = smd 0.4 x 1.75: D+ 0,0; D- -0.65,0; GND 1.3,0; ID 0.65,0; VBUS -1.3,0 | smd 2 x 1.46: SHIELD -2.9,0.275; SHIELD2 2.9,0.275 | smd 1.425 x 2.5: SHIELD3 -0.963,-2.675; SHIELD4 0.963,-2.675 | smd 1.4 x 2.1 bottom: SHIELD5 -2.731,-2.531; SHIELD7 2.729,-2.531 | smd 1 x 1: SHIELD6 2.7,-2.575 | smd 1.1 x 1.5: SHIELD8 -2.731,-2.731 | smd 1 x 1.3 bottom: SHIELD9 -2.43,0.195; SHIELD10 2.43,0.195
1X02_NO_SILK = drill 1.016 pad 1.88: 1 0,0; 2 2.54,0
1X06_NO_SILK = drill 1.016 pad 1.88: 1 0,0; 2 2.54,0; 3 5.08,0; 4 7.62,0; 5 10.16,0; 6 12.7,0
SMT-JUMPER_2_NO_SILK = smd 0.635 x 1.27: 1 -0.406,0; 2 0.406,0
SC70-6 = smd 0.3 x 0.66: 1 -0.65,-0.92; 2 0,-0.92; 3 0.65,-0.92; 4 0.65,0.92; 5 0,0.92; 6 -0.65,0.92
SOT23-3 = smd 0.8 x 0.9: 1 -0.95,-1; 2 0.95,-1; 3 0,1.1
2010 = smd 1.8 x 2.7: 1 -2.2,0; 2 2.2,0
TACTILE_SWITCH_SMD_5.2MM = smd 1.524 x 0.762: 1 -2.794,1.905; 2 2.794,1.905; 3 -2.794,-1.905; 4 2.794,-1.905
ESP-WROOM-32 = smd 0.9 x 1.5: 1 7.7,9; 2 6.43,9; 3 5.16,9; 4 3.89,9; 5 2.62,9; 6 1.35,9; 7 0.08,9; 8 -1.19,9; 9 -2.46,9; 10 -3.73,9; 11 -5,9; 12 -6.27,9; 13 -7.54,9; 14 -8.81,9; 25 -8.81,-9; 26 -7.54,-9; 27 -6.27,-9; 28 -5,-9; 29 -3.73,-9; 30 -2.46,-9; 31 -1.19,-9; 32 0.08,-9; 33 1.35,-9; 34 2.62,-9; 35 3.89,-9; 36 5.16,-9; 37 6.43,-9; 38 7.7,-9 | smd 1.5 x 0.9: 15 -10.3,5.715; 16 -10.3,4.445; 17 -10.3,3.175; 18 -10.3,1.905; 19 -10.3,0.635; 20 -10.3,-0.635; 21 -10.3,-1.905; 22 -10.3,-3.175; 23 -10.3,-4.445; 24 -10.3,-5.715 | smd 6 x 6: GND 0,0
SOT23-5 = smd 0.55 x 1.2: 1 -0.95,-1.3; 2 0,-1.3; 3 0.95,-1.3; 4 0.95,1.3; 5 -0.95,1.3
SO016 = smd 0.6 x 1.2: 1 -4.445,-2.8; 2 -3.175,-2.8; 3 -1.905,-2.8; 4 -0.635,-2.8; 5 0.635,-2.8; 6 1.905,-2.8; 7 3.175,-2.8; 8 4.445,-2.8; 9 4.445,2.8; 10 3.175,2.8; 11 1.905,2.8; 12 0.635,2.8; 13 -0.635,2.8; 14 -1.905,2.8; 15 -3.175,2.8; 16 -4.445,2.8
TSSOP16 = smd 0.4 x 1.6: 1 -2.225,-2.85; 2 -1.575,-2.85; 3 -0.925,-2.85; 4 -0.275,-2.85; 5 0.375,-2.85; 6 1.025,-2.85; 7 1.675,-2.85; 8 2.325,-2.85; 9 2.325,3.05; 10 1.675,3.05; 11 1.025,3.05; 12 0.375,3.05; 13 -0.275,3.05; 14 -0.925,3.05; 15 -1.575,3.05; 16 -2.225,3.05
TSSOP14 = smd 0.305 x 0.991: 1 -1.95,-2.918; 2 -1.3,-2.918; 3 -0.65,-2.918; 4 0,-2.918; 5 0.65,-2.918; 6 1.3,-2.918; 7 1.95,-2.918; 8 1.95,2.918; 9 1.3,2.918; 10 0.65,2.918; 11 0,2.918; 12 -0.65,2.918; 13 -1.3,2.918; 14 -1.95,2.918
NDH = drill 1.016 pad 1.88: 1 0,0; 2 2.54,0; 3 5.08,0; 6 12.7,0; 7 15.24,0; 8 17.78,0; 9 20.32,0
RE-78E = drill 1.016 pad 1.88: 1 0,0; 2 2.54,0; 3 5.08,0

### Placement (x,y rotation side)
C1  38.1,13.97 90 top
C2  16.51,13.97 90 top
C3  16.51,5.08 90 top
C4  38.1,8.89 270 top
C6  55.88,73.66 270 top
C7  5.08,68.58 90 top
C8  3.81,48.26 180 top
C9  3.81,55.88 0 top
C10  15.24,26.67 270 top
C12  53.34,38.1 90 top
C13  54.61,38.1 90 top
C14  53.34,53.34 90 top
C15  54.61,53.34 90 top
C16  44.45,62.23 90 top
C17  2.54,68.58 90 top
C18  48.26,44.45 180 top
C19  48.26,41.91 0 top
C20  53.34,44.45 0 top
C21  53.34,41.91 180 top
C22  41.91,62.23 270 top
D1  11.43,46.99 270 top
D2  24.13,15.24 270 top
D3  24.13,3.81 270 top
D4  15.24,20.32 0 top
D5  3.81,57.15 0 top
D6  8.89,46.99 270 top
D7  7.62,46.99 270 top
D8  11.43,38.1 90 top
D9  24.13,38.1 90 top
D10  3.81,64.77 180 top
D11  3.81,60.96 180 top
FRAME1  -80.01,34.29 0 top  (outside the outline)
J1  5.08,41.91 270 top
J2  64.77,7.62 90 top
J3  64.77,15.24 90 top
J5  64.77,22.86 90 top
J6  62.23,45.72 90 top
J7  64.77,45.72 90 top
J8  64.77,30.48 90 top
JP2  43.18,44.45 180 bottom
JP3  43.18,40.64 180 bottom
Q1  17.78,31.75 0 top
Q4  19.05,21.59 90 top
R1  24.13,11.43 90 top
R2  14.48,46.99 270 top
R3  24.13,7.62 270 top
R4  21.59,5.08 90 top
R5  21.59,13.97 90 top
R6  15.24,22.86 180 top
R7  15.24,31.75 90 top
R8  20.32,31.75 270 top
R9  57.15,73.66 270 top
R10  3.81,58.42 0 top
R11  48.26,55.88 90 top
R12  48.26,68.58 270 top
R13  49.53,55.88 90 top
R14  49.53,68.58 270 top
R15  43.18,66.04 180 top
R16  43.18,67.31 0 top
R17  40.64,34.29 180 top
R18  40.64,33.02 180 top
R19  40.64,49.53 180 top
R20  40.64,48.26 180 top
R21  43.18,58.42 180 top
R22  43.18,57.15 180 top
R23  41.91,40.64 270 top
R24  41.91,44.45 270 top
R25  40.64,35.56 180 top
R26  40.64,50.8 180 top
R27  22.86,21.59 270 top
R28  10.16,38.1 90 top
R29  25.4,38.1 90 top
R30  43.18,44.45 90 top
R31  43.18,40.64 90 top
R32  3.81,63.5 180 top
R33  57.15,67.31 270 top
R34  3.81,62.23 180 top
R35  40.64,8.89 270 top
S3  62.23,67.31 0 top
S4  62.23,73.66 0 top
U1  17.78,60.96 90 top
U2  3.81,52.07 0 top
U3  17.78,38.1 180 top
U$1  48.26,49.53 90 top
U$2  48.26,34.29 90 top
U$3  48.26,62.23 0 top
U$4  7.62,25.4 270 top
U$5  29.21,13.97 270 top
U$6  [KEY#PNG]  58,17 0 top
U$7  [E#STOP#JPG]  57,24 90 top
U$8  [24V#40V3]  56.52,30.48 0 top
U$9  [GND0]  64.74,38.25 90 top
U$10  [GND1]  59.69,33.02 0 top
U$11  [KILL11]  59.69,9.14 90 top
U$12  [RUN10]  54.61,9.02 90 top
U$13  [#RESET14]  54.1,70.74 90 top
U$14  [#013]  54.23,65.91 90 top
U$15  [AUX4]  57.15,58.42 0 top
U$16  [G_X14]  57.78,45.72 0 top
U$17  [G_Y13]  57.91,48.26 0 top
U$18  [L_B12]  58.17,50.8 0 top
U$19  [LPF_BYPASS12]  40.89,47.5 270 bottom
U$20  [L_R14]  58.17,53.34 0 top
U$21  [L_G10]  58.04,55.88 0 top
U$22  [SHADOWGRAPH15]  30.48,73.66 0 top

### Tracks (layer width: path | path; a pad name or v marks a point on that pad's centre or on a via)
0  (via drill 0.38)
  Top 0.305: Q1.6 16.41,32.67 v16.38,32.64 | v22.1,32.64 v26.8,32.64 | U1.25 26.8,52.13 v26.8,50.67 34.42,50.67 v34.92,51.18 | v34.92,69.98 37.65,72.7 52.27,72.7 56.81,68.16 R33.1 58.2,69.22 S3.1 S3.2
  Bottom 0.305: v16.38,32.64 v22.1,32.64 | v26.8,32.64 v26.8,50.67 | v34.92,51.18 v34.92,69.98
3.3V  (via drill 0.38)
  Top 0.305: U$1.9 44.2,51.85 43.94,51.85 | 43.94,51.85 v40.04,51.85 39.79,51.6 R26.2 | U$1.10 44.17,51.2 43.94,51.44 43.94,51.85 | U$2.9 43.94,36.62 | 43.94,36.62 40.17,36.62 39.79,36.23 R25.2 | U$2.10 44.17,35.97 43.94,36.2 43.94,36.62 | 2.86,55.78 C9.1 2.93,55.91 | v58.17,66.55 58.08,66.46 R33.2 56.48,66.46 51.69,71.25 v41.15,71.25 | v58.17,72.77 58.13,72.81 R9.2 | R15.2 v41.15,66.04 | U3.4 18.41,40.77 | 18.41,40.77 18.41,39.88 22.23,36.07 U3.16 v28.7,35.3 v28.7,35.31 | v41.15,58.42 R21.2 | R18.2 v38.73,33.02 29.21,33.02 v28.83,33.4 | v28.7,38.86 28.61,38.95 R29.2 | R28.2 10.16,40.26 10.29,40.39 11.56,40.39 v11.68,40.26 | 18.41,40.77 18.41,43.94 17.91,44.45 15.75,44.45 v15.62,44.32
  Top 0.508: U2.5 v2.86,54.61 2.86,55.78 | C9.1 2.96,57.12 D5.A 1.91,57.15 1.78,57.28 1.78,67.56 1.94,67.73 C17.1 C7.1 6.06,67.73 6.4,67.39 U1.2 | v8.89,51.05 9.53,51.05 11.18,52.7 v15.62,52.7
  Top 0.61: R21.2 R22.2 | R18.2 R17.2 R25.2 | R20.2 R19.2 R26.2
  Bottom 0.305: v58.17,66.55 v58.17,72.77 | v41.15,71.25 41.15,67.18 v41.15,66.04 41.15,61.98 v41.15,58.42 41.15,52.96 40.64,52.45 | 40.64,52.45 v40.04,51.85 | 40.64,52.45 38.73,50.55 v38.73,33.02 | v28.7,38.86 v28.7,35.31 28.7,33.53 v28.83,33.4 | v15.62,44.32 14.92,43.62 12.38,43.62 11.68,42.93 v11.68,40.26
  Bottom 0.406: v15.62,44.32 v15.62,52.7 | v8.89,51.05 5.33,54.61 v2.86,54.61
5V  (via drill 0.38)
  Top 0.305: U$3.3 47.61,61.1 v47.33,61.38 C16.1 | U$3.7 50.21,60.34 v50.16,60.39 | U2.1 2.86,51.76 3.17,52.07 4.45,52.07 4.76,51.76 U2.3 | 11.23,48.06 D1.A
  Top 0.508: C16.1 43.9,60.83 C22.+ | C8.1 4.76,48.36 U2.3
  Top 0.61: C8.1 4.78,48.14 D7.C 8.26,48.14 D6.C 11.16,48.14 D1.A 12.56,47.87 v12.57,47.88 | v33.66,63.88 36.71,60.83 C22.+
  Bottom 0.305: v50.16,60.39 49.17,61.38 v47.33,61.38
  Bottom 0.61: v33.66,63.88 33.66,65.15 30.48,68.33 22.1,68.33 12.57,58.8 v12.57,47.88
12V  (via drill 0.38)
  Top 0.305: U$1.2 48.34,47.95 46.86,46.48 C18.+ | U$2.2 49.53,32.72 | 49.53,32.72 49.45,32.72 48.66,33.51 48.66,42.66 C18.+ | 49.53,32.72 v49.53,31.75 | R24.1 41.91,46.23 42.04,46.35 v42.8,46.35 | v48.26,44.45 C18.+
  Top 0.61: C1.+ 49.4,15.37 v49.53,15.24
  Top 0.762: R5.2 24.08,16.17 D2.A 27.06,16.12 U$5.1 30.61,15.37 C1.+
  Top 1.27: U$4.6 11.29,16.37 C2.+ 21.39,16.37 R5.2
  Bottom 0.305: v42.8,46.35 42.77,46.33 JP2.1 42.77,43.59 43.31,43.05 44.2,43.05 45.59,44.45 v48.26,44.45
  Bottom 0.61: v49.53,15.24 v49.53,31.75
!DTR
  Top 0.254: Q1.1 17.13,31.38 17.02,31.5 15.84,31.5 R7.1
  Top 0.305: U3.13 18.41,34.04 18.03,33.66 14.61,33.66 14.22,33.27 14.22,31.24 14.57,30.9 R7.1
!KILL
  Top 0.305: Q4.1 22.76,20.64 R27.2 52.92,20.74 63.5,10.16 J2.2
!RTS
  Top 0.254: Q1.4 18.43,32.24 18.67,32 19.72,32 R8.1
  Top 0.305: U3.14 19.68,33.23 R8.1
-12V  (via drill 0.38)
  Top 0.305: 45.85,42.92 45.85,46.23 48.22,48.6 U$1.3 | U$2.3 49.95,33.37 v49.66,33.66 | 45.85,42.92 C19.- 48.2,40.57 48.2,33.97 v47.88,33.66 | R23.1 41.91,42.29 42.15,42.53 v42.55,42.53 45.46,42.53 45.85,42.92
  Top 0.61: D3.C v46.99,2.93
  Top 0.762: R4.1 24.08,2.88 D3.C
  Top 1.27: U$4.9 10.02,2.68 C3.- 21.39,2.68 R4.1
  Bottom 0.305: v49.66,33.66 v47.88,33.66 | JP3.1 42.77,42.31 v42.55,42.53
  Bottom 0.61: v47.88,33.66 47.88,3.82 v46.99,2.93
AUX_OUT
  Top 0.305: R14.2 49.53,66.8 48.91,66.18 U$3.10 48.91,63.87 49.4,63.37 57.28,63.37 J6.6
D+  (via drill 0.38)
  Top 0.305: J1.D+ v13.97,41.91 | v17.14,42.16 U3.5
  Bottom 0.305: v17.14,42.16 14.22,42.16 v13.97,41.91
D-
  Top 0.305: J1.D- 15.22,42.56 15.88,41.91 U3.6
G_MOSI  (via drill 0.38)
  Top 0.305: U$1.14 43.14,48.6 v42.8,48.26 | U$2.14 43.14,33.37 v42.8,33.02 | U1.16 13.34,49.66 13.72,49.28 21.45,49.28 22.47,48.26 37.08,48.26 38.99,46.35 v39.5,46.35
  Bottom 0.305: v42.8,33.02 40.01,33.02 39.24,33.78 39.24,46.1 v39.5,46.35 41.4,48.26 v42.8,48.26
G_SCLK  (via drill 0.38)
  Top 0.305: U$1.13 43.07,49.26 v42.8,49.53 | U$2.13 43.07,34.02 v42.8,34.29 | v21.46,53.34 21.46,53.42 U1.13 | v28.7,52.83 35.94,52.83 36.45,53.34 v42.8,53.34
  Bottom 0.305: v42.8,53.34 v42.8,49.53 43.31,49.53 43.5,49.34 43.94,48.9 43.94,47.88 43.18,47.12 42.04,47.12 40.77,45.85 40.77,34.67 41.15,34.29 v42.8,34.29 | v28.7,52.83 21.97,52.83 v21.46,53.34
GND  (via drill 0.38)
  Top 0.305: U$3.12 47.61,66.06 47.42,66.25 47.42,69.26 47.59,69.43 R12.1 R14.1
  Top 0.406: J1.GND 8.54,40.61 8.64,40.51
  Top 0.508: C22.- 43.9,63.63 C16.2 | R32.1 R34.1 v5.71,62.23
  Top 0.762: R1.1 R3.1 22.78,8.47 R4.2 | R1.1 22.78,10.58 R5.1 | C1.- C4.- | R1.1 28.36,10.58 U$5.2
  Top 1.27: R4.2 16.71,7.28 C3.+ 16.51,10.16 | 16.51,10.16 C2.- 16.71,11.77 R5.1 | 16.51,10.16 U$4.7
  other vias: 58.93,73.53 51.18,69.34 51.82,66.17 40.13,66.04 40.13,71.25 34.04,69.34 38.35,68.2 36.7,67.06 40.13,63.12 37.97,63.12 35.81,63.12 32.64,63.88 30.1,64.26 32,61.47 35.81,60.07 33.91,60.07 37.97,59.94 40.26,59.94 47.37,62.36 24,64.9 12.7,66.04 55.63,50.55 52.07,52.7 53.98,55.63 45.21,56.01 51.44,60.2 55.63,45.97 49.15,46.99 34.92,50.04 43.69,52.7 28.7,53.85 23.24,59.94 24.77,56.64 22.35,56.52 22.35,53.59 25.27,62.23 15.6,54.13 11.68,54.13 7.75,51.05 8.89,46.86 1.78,54.61 27.94,38.1 33.53,38.73 35.69,36.07 20.95,43.18 16.38,43.69 19.81,39.62 16.38,38.1 12.7,39.75 11.68,30.73 22.1,33.66 25.91,33.53 27.94,34.42 29.59,31.88 24.38,22.48 50.55,15.24 46.48,3.94 48.9,53.59 53.34,60.96 55.88,60.96 58.42,60.96 59.69,57.15 57.15,57.15 59.69,54.61 53.34,58.42 59.69,52.07 58.42,49.53 55.88,52.07 58.42,44.45 47.12,49.15 60.96,41.91 58.42,39.37 50.8,39.37 63.5,39.37 60.96,36.83 55.88,36.83 58.42,34.29 55.88,31.75 2.54,74.93 2.54,72.39 5.08,72.39 7.62,74.93 5.08,74.93 7.62,72.39 10.16,72.39 10.16,74.93 12.7,74.93 12.7,72.39 15.24,72.39 17.78,72.39 20.32,72.39 15.24,74.93 17.78,74.93 20.32,74.93 22.86,74.93 25.4,74.93 27.94,74.93 30.48,74.93 30.48,72.39 22.86,72.39 25.4,72.39 27.94,72.39 34.29,76.2 36.83,76.2 39.37,76.2 41.91,76.2 44.45,76.2 46.99,76.2 49.53,76.2 52.07,76.2 54.61,76.2 62.23,73.66 62.23,67.31 58.42,63.5 55.88,64.77 53.34,64.77 53.34,67.31 63.5,60.96 60.96,60.96 62.23,63.5 29.21,45.72 35.56,45.72 31.75,45.72 24.13,45.72 31.75,36.83 21.59,27.94 25.4,29.21 29.21,27.94 33.02,29.21 36.83,27.94 40.64,29.21 29.21,5.08 31.75,5.08 34.29,5.08 36.83,5.08 39.37,5.08 41.91,5.08 54.61,17.78 57.15,15.24 59.69,12.7 54.61,12.7 52.07,15.24 52.07,10.16 57.15,10.16 59.69,7.62 54.61,7.62 52.07,5.08 57.15,5.08 62.23,5.08 54.61,2.54 59.69,2.54 64.77,2.54 1.27,35.56 3.81,35.56 6.35,35.56 1.27,49.53 25.4,19.05 29.21,17.78 33.02,19.05 36.83,17.78 40.64,19.05 44.45,17.78 29.21,22.86 33.02,22.86 36.83,22.86 40.64,22.86 44.45,22.86 60.96,31.75 63.5,29.21 53.34,29.21 58.42,29.21 55.88,26.67 60.96,26.67 44.45,27.94 15.24,68.58 17.78,68.58 15.24,66.04 12.7,63.5 12.7,60.96
  pour Top (isolate 0.152, rank 3): 0,0 0,77.47 66.04,77.47 66.04,0
  pour Bottom (isolate 0.152, rank 3): 0,0 66.04,0 66.04,77.47 0,77.47
GX_!CS  (via drill 0.38)
  Top 0.305: R17.1 41.7,34.29 42.5,35.09 43.05,35.09 43.48,34.66 U$2.12 46.48,34.66 46.99,35.18 46.99,37.21 46.35,37.85 v32.77,37.85 | U1.33 32.72,62.31 v32.77,62.36
  Bottom 0.305: v32.77,62.36 v32.77,37.85
GX_!LDAC  (via drill 0.38)
  Top 0.305: U$2.15 44.07,32.72 43.23,31.88 41.53,31.88 | R18.1 41.49,31.92 41.53,31.88 | U1.31 27.89,59.77 28.32,60.2 v30.61,60.2 | v30.61,31.88 41.53,31.88
  Bottom 0.305: v30.61,60.2 v30.61,31.88
GX_!RST  (via drill 0.38)
  Top 0.305: R25.1 41.74,35.81 43.56,35.81 44.06,35.31 U$2.11 46.24,35.31 46.35,35.43 46.35,36.96 46.1,37.21 37.34,37.21 36.83,36.7 v36.83,36.07 | U1.36 v36.7,66.12
  Bottom 0.305: v36.83,36.07 36.69,36.21 36.69,66.11 v36.7,66.12
GX_OUT
  Top 0.305: U$2.1 54.36,32.06 62.23,39.94 J6.1
GY_!CS  (via drill 0.38)
  Top 0.305: R19.1 41.51,49.55 41.72,49.55 42.4,50.23 43.11,50.23 43.43,49.91 U$1.12 46.86,49.91 v47.12,50.16 | v44.45,53.47 43.23,54.69 U1.27
  Bottom 0.305: v44.45,53.47 47.12,50.8 v47.12,50.16
GY_!LDAC
  Top 0.305: U$1.15 44.07,47.95 43.23,47.12 41.78,47.12 41.53,47.12 | U1.23 22.23,49.4 22.73,48.9 37.42,48.9 39.2,47.12 41.53,47.12 | R20.1 41.49,47.16 41.53,47.12
GY_!RST
  Top 0.305: R26.1 41.74,51.05 43.56,51.05 44.06,50.55 U$1.11 46.36,50.55 46.86,51.05 46.86,52.45 43.94,55.37 28.66,55.37 28.07,55.96 26.67,55.96 U1.28
GY_OUT
  Top 0.305: J6.2 61.27,47.3 U$1.1
L_!CLR  (via drill 0.38)
  Top 0.305: v45.21,66.04 R15.1 44.03,65.37 43.81,65.15 29.59,65.15 v29.46,65.02 | v50.67,67.31 49.99,66.62 49.99,66.61 49.56,66.19 U$3.9 | U1.10 21.67,57.23 v23.24,58.8
  Bottom 0.305: v45.21,66.04 49.4,66.04 v50.67,67.31 | v29.46,65.02 v23.24,58.8
L_!LDAC  (via drill 0.38)
  Top 0.305: U$3.1 46.31,58.76 45.97,58.42 45.21,58.42 R21.1 44.03,59.09 43.9,59.23 28.75,59.23 v28.7,59.18 | v23.62,56.64 22.92,55.94 21.8,54.82 8.91,54.82 U1.12
  Bottom 0.305: v23.62,56.64 25.59,58.61 26.16,59.18 v28.7,59.18
L_!SYNC  (via drill 0.38)
  Top 0.305: U$3.2 46.96,57.76 46.35,57.15 v45.21,57.15 R22.1 44.03,56.35 43.81,56.13 v29.08,56.13 | U1.11 21.26,55.96 v21.59,55.63
  Bottom 0.305: v21.59,55.63 22.23,54.99 27.94,54.99 v29.08,56.13
L_MOSI
  Top 0.305: U$3.13 46.96,68.48 45.97,69.47 43.81,69.47 37.85,69.47 35.77,67.39 U1.37
L_SCLK  (via drill 0.38)
  Top 0.305: U$3.14 46.31,67.99 45.59,68.71 v39.24,68.71 | U1.30 39.16,58.5 v39.24,58.42
  Bottom 0.305: v39.24,58.42 v39.24,68.71
LASER_B
  Top 0.305: R13.2 49.53,57.53 48.9,58.17 48.9,59.3 U$3.5 48.91,60.59 49.4,61.09 51.94,61.09 J6.3
LASER_G
  Top 0.305: R12.2 U$3.11 48.26,63.12 48.77,62.61 55.5,62.61 J6.5
LASER_R
  Top 0.305: R11.2 U$3.4 48.26,61.34 48.77,61.85 53.72,61.85 J6.4
N$1
  Top 0.61: D1.C 14.45,46.11 R2.2
N$2  (via drill 0.38)
  Top 0.305: U$3.8 50.21,65.7 51.82,67.31 v51.82,68.58 | v45.21,67.31 R16.2
  Bottom 0.305: v51.82,68.58 46.48,68.58 v45.21,67.31
N$3
  Top 0.762: D2.C R1.2
N$4
  Top 0.61: D4.A 16.39,21.2 16,21.59 14.68,21.59 14.39,21.88 R6.2
N$5
  Top 0.762: R3.2 D3.A
N$6
  Top 0.305: 4.69,58.39 R10.2
  Top 0.508: D5.C 4.69,58.39
N$7  (via drill 0.38)
  Top 0.61: D6.A v8.89,44.96 | C4.+ 40.09,7.49 R35.2
  Top 0.762: U$5.3 30.61,7.49 C4.+
  Bottom 0.61: v8.89,44.96 8.89,29.21 16.51,21.59 16.51,12.7 20.32,8.89 U$5.3
N$9
  Top 1.219: J5.1 J3.2
  Bottom 1.219: J5.1 J3.2
N$10
  Top 0.254: R7.2 15.94,31.9 17.68,31.9 17.78,32 Q1.5
N$12
  Top 0.254: Q1.2 17.78,31.37 17.91,31.5 19.72,31.5 R8.2
N$13
  Top 0.61: D8.A 11.4,37.25 R28.1
N$14
  Top 0.61: D9.A 25.37,37.22 R29.1
N$15
  Top 0.61: R30.1 R24.2
N$16
  Top 0.61: R31.1 R23.2
N$17
  Top 0.508: R32.2 2.96,64.74 D10.C
N$18
  Top 0.508: R34.2 2.96,60.99 D11.C
N$38  (via drill 0.38)
  other vias: 25.78,50.67
RESET  (via drill 0.38)
  Top 0.305: Q1.3 18.43,30.24 18.16,29.97 v10.92,29.97 | U1.3 10.84,66.12 v10.92,66.04 15.62,70.74 32.38,70.74 36.16,74.51 56.13,74.51 | S4.2 59.69,75.56 | 59.69,75.56 S4.1 | C6.1 56.13,74.51 | 56.13,74.51 R9.1 58.2,75.56 59.69,75.56
  Bottom 0.305: v10.92,29.97 10.92,35.05 10.29,35.69 10.29,44.32 10.92,44.96 v10.92,66.04
RXI  (via drill 0.38)
  Top 0.305: v20.95,42.16 U3.2 20.95,40.01 21.98,38.98 D9.C | v25.27,63.5 25.35,63.58 U1.34
  Bottom 0.305: v25.27,63.5 19.18,57.4 19.18,43.94 v20.95,42.16
SHIELD  (via drill 0.38)
  Bottom 0.305: J1.SHIELD5 1.47,45.72 v1.27,45.72
  pour Top (isolate 0.305, rank 2): 0,46.99 7.62,46.99 7.62,36.83 0,36.83
  pour Bottom (isolate 0.305, rank 2): 0,46.99 7.62,46.99 7.62,36.83 0,36.83
SHTDWN
  Top 0.61: R6.1 17.65,22.86 17.95,22.56 Q4.3
SHTDWN_BASE
  Top 0.61: U$4.3 D4.C
TXO  (via drill 0.38)
  Top 0.305: U3.3 v19.68,42.16 | v25.27,64.9 25.32,64.85 U1.35 | v17.14,38.61 16.78,38.98 D8.C
  Bottom 0.305: 18.54,43.31 18.54,58.17 v25.27,64.9 | v19.68,42.16 18.54,43.31 | 18.54,43.31 18.54,40.01 v17.14,38.61
ULED1
  Top 0.508: D10.A 5.33,64.77 7.79,62.31 U1.6
ULED2
  Top 0.508: U1.7 4.77,61.04 D11.A
V_USB
  Top 0.406: J1.VBUS 7.27,43.21 7.62,43.56 D7.A
VCC  (via drill 0.38)
  Top 0.305: Q4.2 20.05,23.61 20.7,24.26 51.31,24.26 v51.69,23.88
  Top 1.219: J8.1 J5.2
  Bottom 0.61: J2.1 63.5,7.62 62.23,8.89 62.23,25.4 | v51.69,23.88 53.21,25.4 62.23,25.4 | J5.2 62.23,25.4
  Bottom 1.219: J5.2 J8.1
VCC_SWITCHED
  Top 1.219: J3.1 62.36,15.24 52.33,25.27 C10.+ 10.03,25.27 U$4.2
VREFH  (via drill 0.38)
  Top 0.305: 52.58,35.31 U$2.6 | 52.58,35.31 v54.61,35.31 C13.1 | 52.51,50.55 U$1.6 | U$1.5 52.32,49.91 52.51,50.09 52.51,50.55 | C15.1 v54.61,50.55 52.51,50.55 | U$2.5 52.45,34.66 52.58,34.8 52.58,35.31 | C20.+ 54.61,44.58 v54.61,45.97 v48.26,45.97 | R30.2 43.85,45.97 v44.45,45.97
  Bottom 0.305: v54.61,50.55 v54.61,45.97 v54.61,35.31 | v48.26,45.97 v44.45,45.97 43.94,45.97 43.59,45.62 JP2.2
VREFL  (via drill 0.38)
  Top 0.305: 52.45,51.2 U$1.7 | 52.45,51.2 53.24,51.2 v53.34,51.31 C14.1 | U$1.8 52.28,51.85 52.45,51.69 52.45,51.2 | 52.58,35.97 U$2.7 | 52.58,35.97 53.24,35.97 v53.34,36.07 C12.1 | U$2.8 52.41,36.62 52.58,36.45 52.58,35.97 | C21.- 54.61,41.78 54.48,41.91 v53.34,41.91 | v44.32,41.87 43.56,41.87 R31.2
  Bottom 0.305: v53.34,51.31 v53.34,41.91 | v53.34,41.91 53.34,40.26 v53.34,36.07 | v53.34,41.91 44.36,41.91 v44.32,41.87 43.9,41.87 43.59,41.55 JP3.2